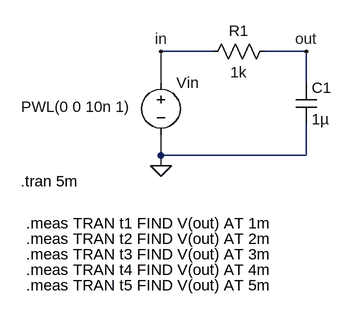
[diagram p0: schematic TRAN.asc]
TRAN.asc, the LTspice schematic file:
Version 4
SHEET 1 880 680
WIRE 160 96 80 96
WIRE 304 96 240 96
WIRE 80 144 80 96
WIRE 304 144 304 96
WIRE 80 256 80 224
WIRE 304 256 304 208
WIRE 304 256 80 256
WIRE 80 272 80 256
FLAG 80 272 0
FLAG 80 96 in
FLAG 304 96 out
SYMBOL voltage 80 128 R0
WINDOW 3 -215 53 Left 2
WINDOW 123 0 0 Left 0
WINDOW 39 0 0 Left 0
SYMATTR Value PWL(0 0 10n 1)
SYMATTR InstName Vin
SYMBOL res 144 112 R270
WINDOW 0 32 56 VTop 2
WINDOW 3 0 56 VBottom 2
SYMATTR InstName R1
SYMATTR Value 1k
SYMBOL cap 288 144 R0
SYMATTR InstName C1
SYMATTR Value 1µ
TEXT -136 296 Left 2 !.tran 5m
TEXT -128 360 Left 2 !.meas TRAN t1 FIND V(out) AT 1m
TEXT -128 384 Left 2 !.meas TRAN t2 FIND V(out) AT 2m
TEXT -128 408 Left 2 !.meas TRAN t3 FIND V(out) AT 3m
TEXT -128 432 Left 2 !.meas TRAN t4 FIND V(out) AT 4m
TEXT -128 456 Left 2 !.meas TRAN t5 FIND V(out) AT 5m

The netlist it stands for:
* TRAN.asc
Vin in 0 PWL(0 0 10n 1)
R1 in out 1k
C1 out 0 1µ
.tran 5m
.meas TRAN t1 FIND V(out) AT 1m
.meas TRAN t2 FIND V(out) AT 2m
.meas TRAN t3 FIND V(out) AT 3m
.meas TRAN t4 FIND V(out) AT 4m
.meas TRAN t5 FIND V(out) AT 5m
.backanno
.end